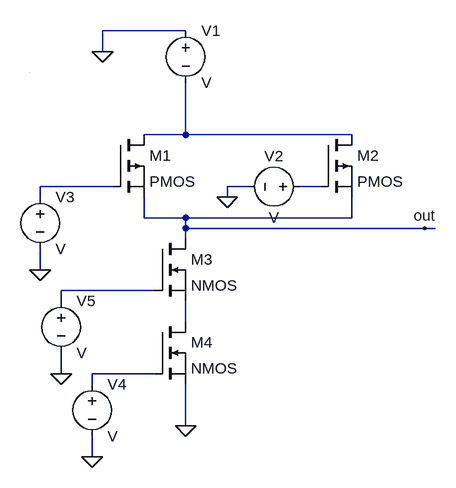
[diagram p0: schematic Draft10.asc]
Draft10.asc, the LTspice schematic file:
Version 4
SHEET 1 880 680
WIRE 240 -64 112 -64
WIRE 112 -32 112 -64
WIRE 240 96 240 16
WIRE 240 96 176 96
WIRE 496 96 240 96
WIRE 128 176 16 176
WIRE 336 176 304 176
WIRE 448 176 416 176
WIRE 16 192 16 176
WIRE 304 192 304 176
WIRE 176 224 176 192
WIRE 240 224 176 224
WIRE 496 224 496 192
WIRE 496 224 240 224
WIRE 240 240 240 224
WIRE 608 240 240 240
WIRE 624 240 608 240
WIRE 240 256 240 240
WIRE 16 304 16 272
WIRE 192 336 48 336
WIRE 48 352 48 336
WIRE 240 384 240 352
WIRE 48 464 48 432
WIRE 192 464 96 464
WIRE 96 480 96 464
WIRE 240 544 240 480
WIRE 96 592 96 560
WIRE 0 0 0 0
FLAG 240 544 0
FLAG 112 -32 0
FLAG 304 192 0
FLAG 608 240 out
FLAG 16 304 0
FLAG 96 592 0
FLAG 48 464 0
SYMBOL pmos 128 96 R0
SYMATTR InstName M1
SYMBOL pmos 448 96 R0
SYMATTR InstName M2
SYMBOL nmos 192 256 R0
SYMATTR InstName M3
SYMBOL nmos 192 384 R0
SYMATTR InstName M4
SYMBOL voltage 240 -80 R0
SYMATTR InstName V1
SYMBOL voltage 432 176 R90
WINDOW 0 -32 56 VBottom 2
WINDOW 3 32 56 VTop 2
SYMATTR InstName V2
SYMBOL voltage 16 176 R0
SYMATTR InstName V3
SYMBOL voltage 96 464 R0
SYMATTR InstName V4
SYMBOL voltage 48 336 R0
SYMATTR InstName V5

The netlist it stands for:
* Draft10.asc
M1 N001 N002 out out PMOS
M2 N001 N003 out out PMOS
M3 out N004 N005 N005 NMOS
M4 N005 N006 0 0 NMOS
V1 0 N001 V
V2 N003 0 V
V3 N002 0 V
V4 N006 0 V
V5 N004 0 V
.model NMOS NMOS
.model PMOS PMOS
.lib standard.mos
.backanno
.end